# Altium project RA-Manager_Controller.PrjPcb
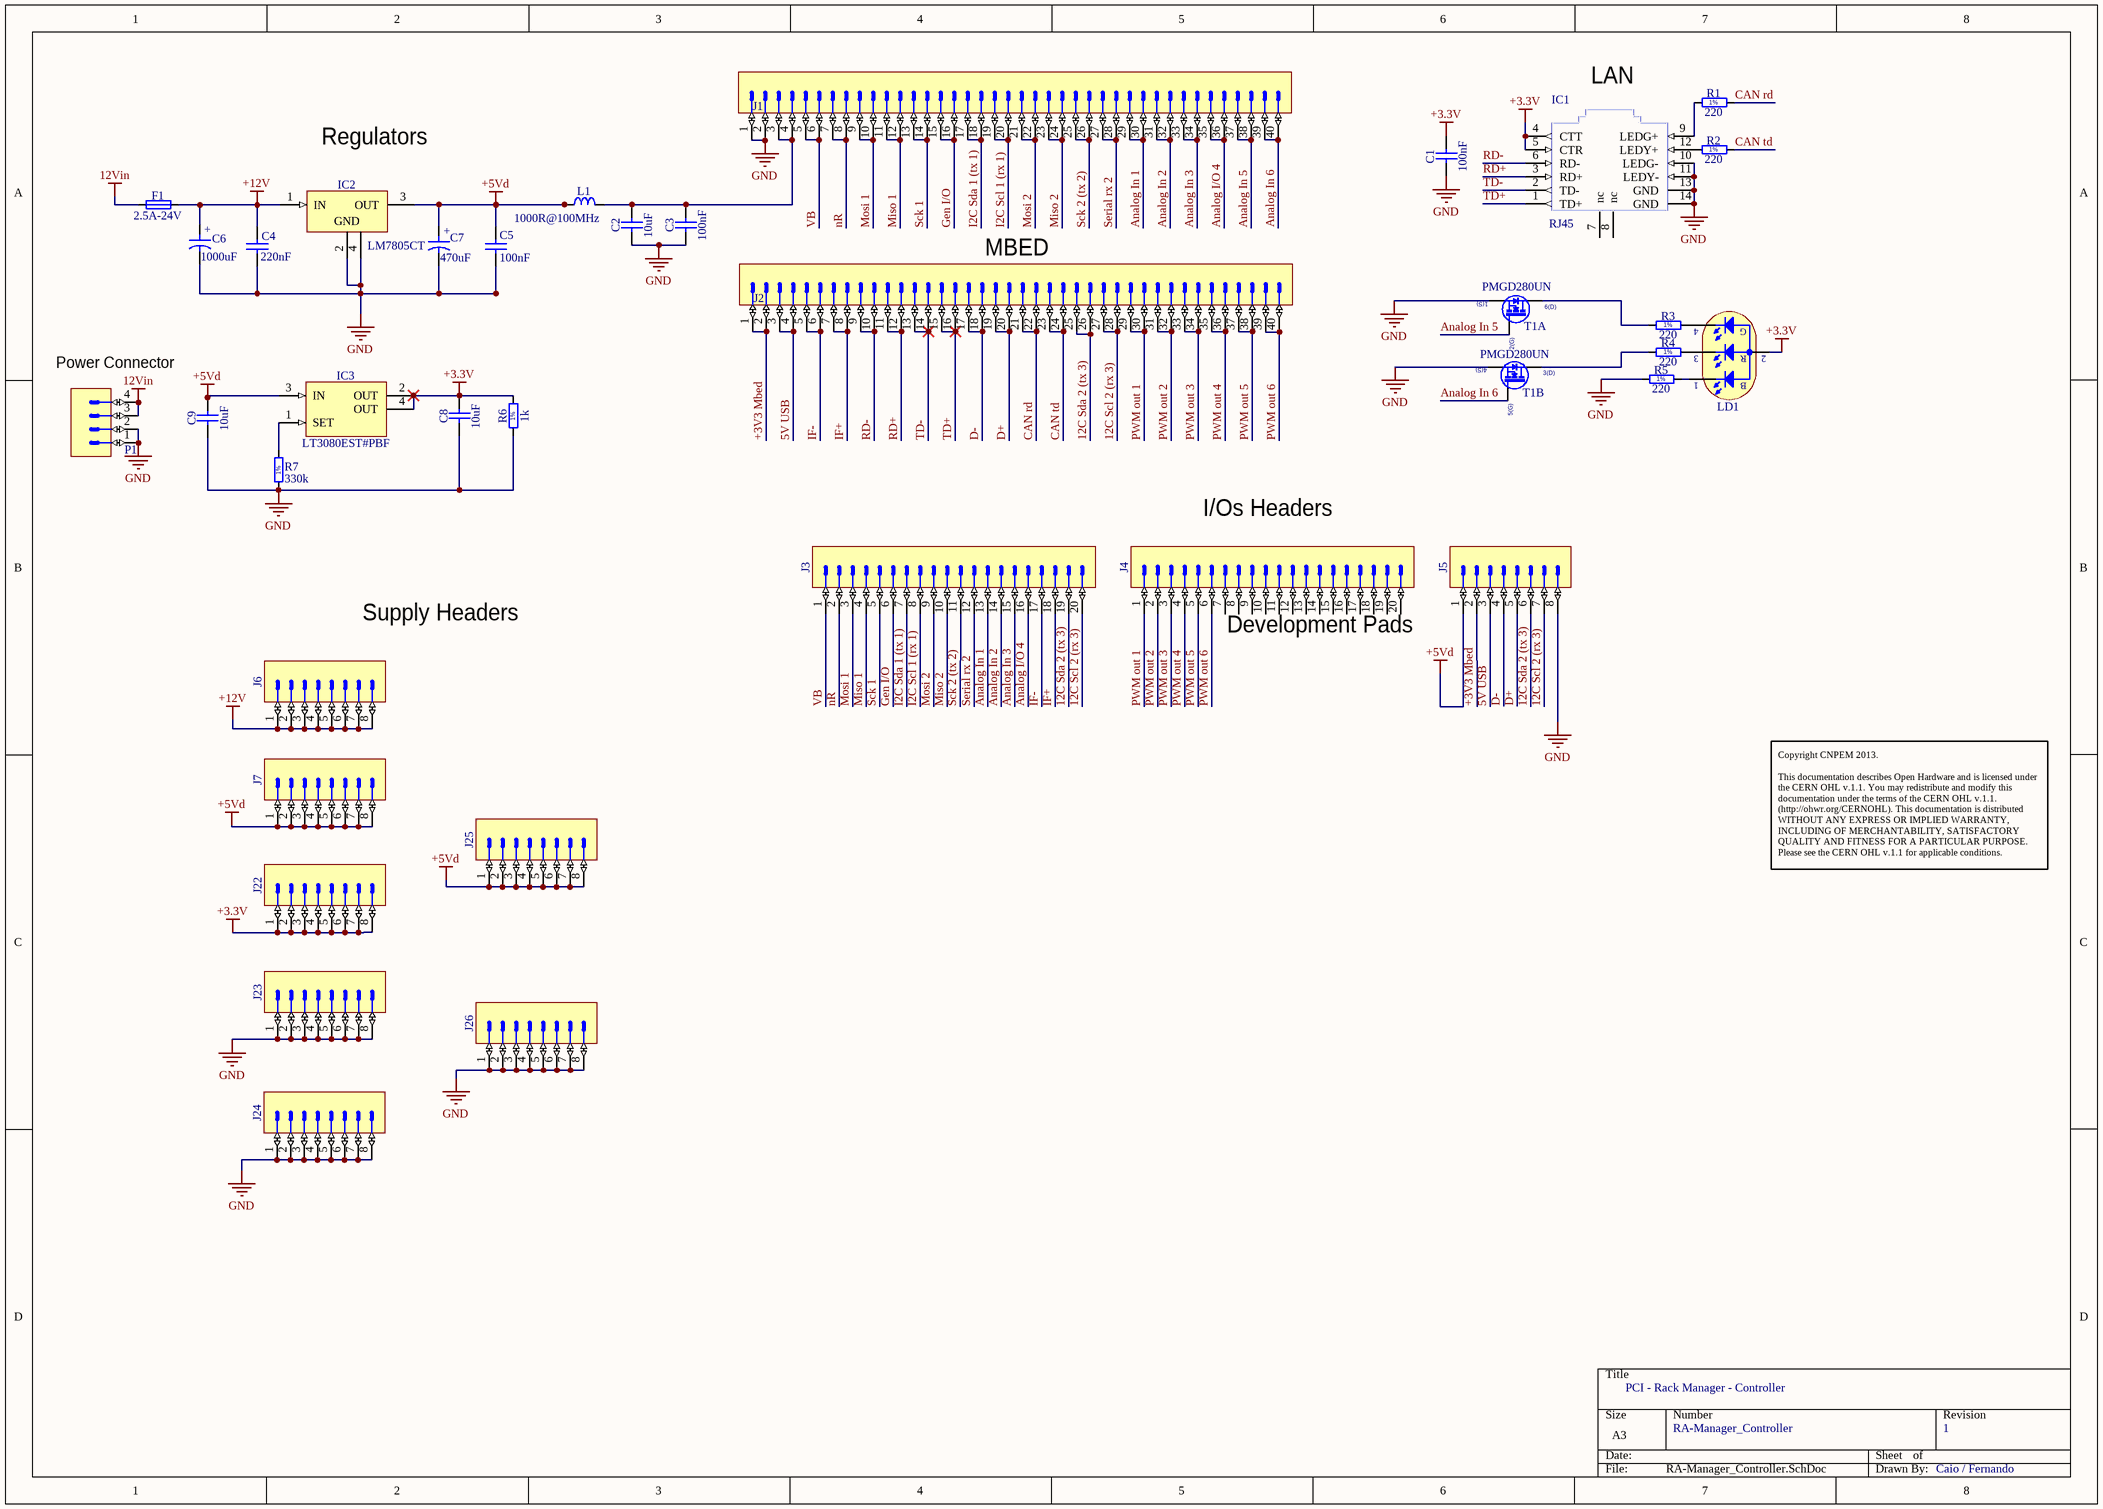
[diagram p0: RA-Manager_Controller.SchDoc]
1 sheet, 36 parts. Net scope: global (net labels, ports and power ports of the same name join across sheets).
Board file: RA-Manager_Controller.PcbDoc

## Sheet RA-Manager_Controller.SchDoc
size A3

### Parts
C1  100nF  [CAPC1608X87N]
C2  10uF  [CAPC3216X180N]
C3  100nF  [CAPC1608X87N]
C4  220nF  [CAPR500-250X720X650]
C5  100nF  [CAPR500-250X720X650]
C6  1000uF  [CAPPR500-1300X2700]
C7  470uF  [CAPPR500-1050X1150]
C8  10uF  [CAPC3216X180N]
C9  10uF  [CAPC3216X180N]
F1  2.5A-24V  [FUSC1608X55N]
IC1  RJ45  [J0006D21BNL]
IC2  LM7805CT  [TO-220-H]
IC3  LT3080EST#PBF  [SOT230P700X180-4N]
J1  (no value)  [TYCO_2-534998-0]
J2  (no value)  [TYCO_2-534998-0]
J3  (no value)  [TYCO_2-87224-0]
J4  (no value)  [TYCO_2-87224-0]
J5  (no value)  [HARWIN_D01-9922046_8OF20]
J6  (no value)  [HARWIN_D01-9922046_8OF20]
J7  (no value)  [HARWIN_D01-9922046_8OF20]
J22  (no value)  [HARWIN_D01-9922046_8OF20]
J23  (no value)  [HARWIN_D01-9922046_8OF20]
J24  (no value)  [HARWIN_D01-9922046_8OF20]
J25  (no value)  [HARWIN_D01-9922046_8OF20]
J26  (no value)  [HARWIN_D01-9922046_8OF20]
L1  1000R@100MHz  [INDC1608X95N]
LD1  Blue/Red/Green  [LED_AVAGO_HSMF-C113]  (value not drawn)
P1  Header 4  [JST_B4B-XH-A(LF)(SN)]  (value not drawn)
R1  220  [RESC2012X60N]
R2  220  [RESC2012X60N]
R3  220  [RESC2012X60N]
R4  220  [RESC2012X60N]
R5  220  [RESC2012X60N]
R6  1k  [RESC1608X55N]
R7  330k  [RESC2012X60N]
T1  PMGD280UN  [SOT65P210X110-6N]  (parts A,B of 2)

### Nets
12Vin: F1.1 P1.3 P1.4
+3.3V: C1.2 C8.2 IC1.4(CTT) IC1.5(CTR) IC3.2(OUT) IC3.4(OUT) J22.1 J22.2 J22.3 J22.4 J22.5 J22.6 J22.7 J22.8 LD1.2(AC) R6.2
+5Vd: C5.2 C7.1 C9.2 IC2.3(OUT) IC3.3(IN) J5.1 J7.1 J7.2 J7.3 J7.4 J7.5 J7.6 J7.7 J7.8 J25.1 J25.2 J25.3 J25.4 J25.5 J25.6 J25.7 J25.8 L1.1
+12V: C4.2 C6.1 F1.2 IC2.1(IN) J6.1 J6.2 J6.3 J6.4 J6.5 J6.6 J6.7 J6.8
GND: C1.1 C2.1 C3.1 C4.1 C5.1 C6.2 C7.2 C8.1 C9.1 IC1.10(LEDG-) IC1.11(LEDY-) IC1.13(GND) IC1.14(GND) IC2.2(GND) IC2.4(GND) J1.1 J1.2 J5.8 J23.1 J23.2 J23.3 J23.4 J23.5 J23.6 J23.7 J23.8 J24.1 J24.2 J24.3 J24.4 J24.5 J24.6 J24.7 J24.8 J26.1 J26.2 J26.3 J26.4 J26.5 J26.6 J26.7 J26.8 P1.1 P1.2 R5.1 R6.1 R7.1 T1.1(S) T1.4(S)
5V USB: J2.3 J2.4 J5.3
12C Scl 2 (rx 3): J2.27 J2.28 J3.20 J5.7
12C Sda 2 (tx 3): J2.25 J2.26 J3.19 J5.6
+3V3 Mbed: J2.1 J2.2 J5.2
Analog I/O 4: J1.35 J1.36 J3.16
Analog In 1: J1.29 J1.30 J3.13
Analog In 2: J1.31 J1.32 J3.14
Analog In 3: J1.33 J1.34 J3.15
Analog In 5: J1.37 J1.38 T1.2(G)
Analog In 6: J1.39 J1.40 T1.5(G)
CAN rd: J2.21 J2.22 R1.2
CAN td: J2.23 J2.24 R2.2
D+: J2.19 J2.20 J5.5
D-: J2.17 J2.18 J5.4
Gen I/O: J1.15 J1.16 J3.6
I2C Scl 1 (rx 1): J1.19 J1.20 J3.8
I2C Sda 1 (tx 1): J1.17 J1.18 J3.7
IF+: J2.7 J2.8 J3.18
IF-: J2.5 J2.6 J3.17
Miso 1: J1.11 J1.12 J3.4
Miso 2: J1.23 J1.24 J3.10
Mosi 1: J1.9 J1.10 J3.3
Mosi 2: J1.21 J1.22 J3.9
nR: J1.7 J1.8 J3.2
PWM out 1: J2.29 J2.30 J4.1
PWM out 2: J2.31 J2.32 J4.2
PWM out 3: J2.33 J2.34 J4.3
PWM out 4: J2.35 J2.36 J4.4
PWM out 5: J2.37 J2.38 J4.5
PWM out 6: J2.39 J2.40 J4.6
RD+: IC1.3(RD+) J2.11 J2.12
RD-: IC1.6(RD-) J2.9 J2.10
Sck 1: J1.13 J1.14 J3.5
Sck 2 (tx 2): J1.25 J1.26 J3.11
Serial rx 2: J1.27 J1.28 J3.12
TD+: IC1.1(TD+) J2.15 J2.16
TD-: IC1.2(TD-) J2.13 J2.14
VB: J1.5 J1.6 J3.1
NetC2_2: C2.2 C3.2 J1.3 J1.4 L1.2
NetIC1_9: IC1.9(LEDG+) R1.1
NetIC1_12: IC1.12(LEDY+) R2.1
NetIC3_1: IC3.1(SET) R7.2
NetLD1_1: LD1.1(CB) R5.2
NetLD1_3: LD1.3(CR) R4.2
NetLD1_4: LD1.4(CG) R3.2
NetR3_1: R3.1 T1.6(D)
NetR4_1: R4.1 T1.3(D)

Not connected (* = marked no-connect by the designer): IC1 7(nc) 8(nc); J4 7 8 9 10 11 12 13 14 15 16 17 18 19 20

### Notes on the sheet
- (near IC1) LAN
- (near IC2) Regulators
- (near J2) MBED
- Power Connector
- I/Os Headers
- Supply Headers
- (near J4) Development Pads
- Copyright CNPEM 2013.
  This documentation describes Open Hardware and is licensed under the CERN OHL v.1.1. You may redistribute and modify this documentation under the terms of the CERN OHL v.1.1. (http://ohwr.org/CERNOHL). This documentation is distributed WITHOUT ANY EXPRESS OR IMPLIED WARRANTY, INCLUDING OF MERCHANTABILITY, SATISFACTORY QUALITY AND FITNESS FOR A PARTICULAR PURPOSE. Please see the CERN OHL v.1.1 for applicable conditions.
- PCI - Rack Manager - Controller
- RA-Manager_Controller
- 1
- Caio / Fernando
- (in symbol CAER_470UF_10V_20%_500-1050X1150_LESR0R015) +
- (in symbol CAER_1000UF_25V_20%_500-1300X2700_LESR0R034) +
- (in symbol LED_AVAGO_HSMF-C113) G; R; B
- (in symbol PMGD280UN, part A) 6(D); 1(S); 2(G)
- (in symbol PMGD280UN, part B) 3(D); 4(S); 5(G)
- (in symbol R0603_1K_1%_0.1W_100PPM) 1%
- (in symbol R0805_220R_1%_0.125W_100PPM) 1%
- (in symbol R0805_330K_1%_0.125W_100PPM) 1%

### Library data of the parts
C1 C3 = CC0603_100NF_50V_10%_X7R: Non-polarised capacitor; Manufacturer: GENERIC; Part Description: SMD Multilayer Chip Ceramic Capacitor; Manufacturer1 Part Number: 223858615649; Tolerance: ±10%; Voltage: 50V; TC: X7R; Manufacturer Part Number: CC0603_100NF_50V_10%_X7R; Part Number: CC0603_100NF_50V_10%_X7R; Component Kind: Standard; Component Type: Standard; Pin Count: 2; Value: 100nF; Status: Preferred; Case: 0603; Mounted: Yes; Socket: No; SMD: Yes; Sense: No; Manufacturer1 Example: PHYCOMP; Manufacturer1 ComponentHeight: 0.87mm; HelpURL: \\cern.ch\dfs\Applications\Altium\Datasheets\CC0603_X7R_PHYCOMP.pdf; Author: CERN DEM JLC; CreateDate: 03/12/2007; LatestRevisionDate: 03/12/2007
C2 C8 C9 = CC1206_10UF_25V_10%_X7R: Non-polarised capacitor; Manufacturer: GENERIC; Part Description: SMD Multilayer Chip Ceramic Capacitor; Manufacturer1 Part Number: C1206C106K4RACTU; Tolerance: ±10%; Voltage: 25V; TC: X7R; Manufacturer Part Number: CC1206_10uF_25V_10%_X7R; Part Number: CC1206_10UF_25V_10%_X7R; Component Kind: Standard; Component Type: Standard; Pin Count: 2; Value: 10uF; Status: Preferred; Case: 1206; Mounted: Yes; Socket: No; SMD: Yes; Sense: No; Manufacturer1 Example: KEMET; Manufacturer1 ComponentHeight: 1.8mm; HelpURL: \\cern.ch\dfs\Applications\Altium\Datasheets\CC1206_X7R_KEMET.pdf; Author: CERN DEM JLC; CreateDate: 12/09/2012; LatestRevisionDate: 12/09/2012
C4 = CPER_220NF_63V_10%_500-250X720X650: Non-polarised capacitor; Part Description: Metallized Polyester Film Capacitor (MKT); Manufacturer: TDK; Manufacturer Part Number: B32529C0224K000; Voltage: 63VDC/40VAC; Tolerance: ±10%; Part Number: CPER_220NF_63V_10%_500-250X720X650; Component Kind: Standard; Component Type: Standard; Pin Count: 2; Value: 220nF; Status: None; Case: LS5 W2.5 x L7.2 x H6.5; Mounted: Yes; Socket: No; SMD: No; Sense: No; ComponentHeight: 6.5mm; HelpURL: \\cern.ch\dfs\Applications\Altium\Datasheets\CPER_TDK_B32529.pdf; Author: CERN DEM JLC; CreateDate: 19/12/2007; LatestRevisionDate: 22/04/2015
C5 = CPER_100NF_63V_10%_500-250X720X650: Non-polarised capacitor; Part Description: Metallized Polyester Film Capacitor (MKT); Manufacturer: TDK; Manufacturer Part Number: B32529C0104K000; Voltage: 63VDC/40VAC; Tolerance: ±10%; Part Number: CPER_100NF_63V_10%_500-250X720X650; Component Kind: Standard; Component Type: Standard; Pin Count: 2; Value: 100nF; Status: None; Case: LS5 W2.5 x L7.2 x H6.5; Mounted: Yes; Socket: No; SMD: No; Sense: No; ComponentHeight: 6.5mm; HelpURL: \\cern.ch\dfs\Applications\Altium\Datasheets\CPER_TDK_B32529.pdf; Author: CERN DEM JLC; CreateDate: 19/12/2007; LatestRevisionDate: 19/12/2007
C6 = CAER_1000UF_25V_20%_500-1300X2700_LESR0R034: Polarised capacitor; Part Description: Low ESR 0R034 Aluminum Electrolytic Capacitor (136RVI Series); Manufacturer: VISHAY BCCOMPONENTS; Manufacturer Part Number: MAL213666102E3; Voltage: 25V; Tolerance: ±20%; Part Number: CAER_1000UF_25V_20%_500-1300X2700_LESR0R034; Component Kind: Standard; Component Type: Standard; Pin Count: 2; Value: 1000uF; Status: Preferred; Case: LS5 D13 x H27; Mounted: Yes; Socket: No; SMD: No; Sense: No; ComponentHeight: 27mm; HelpURL: \\cern.ch\dfs\Applications\Altium\Datasheets\CAER-LESR_VISHAY_136RVI.pdf; Author: CERN DEM JLC; CreateDate: 03/07/2008; LatestRevisionDate: 16/03/2009
C7 = CAER_470UF_10V_20%_500-1050X1150_LESR0R015: Polarised capacitor; Part Description: Low ESR 0R015 Aluminum Solid Capacitor With Organic Semiconductive Electrolyte; Manufacturer: SANYO OS-CON; Manufacturer Part Number: 10SP470M; Voltage: 10V; Tolerance: ±20%; Part Number: CAER_470UF_10V_20%_500-1050X1150_LESR0R015; Component Kind: Standard; Component Type: Standard; Pin Count: 2; Value: 470uF; Status: Obsolete; Case: LS5 D10.5 x H11.5; Mounted: Yes; Socket: No; SMD: No; Sense: No; ComponentHeight: 11.5mm; HelpURL: \\cern.ch\dfs\Applications\Altium\Datasheets\CAER-LESR_SANYO_SP.pdf; Author: CERN DEM JLC; CreateDate: 29/01/2008; LatestRevisionDate: 16/03/2009
F1 = FUS0603_BOURNS-SF-0603F250-2: Fuse; Part Description: Thin Film Chip Fuse; Manufacturer: BOURNS; PressFit: No; Part Number: FUS0603_BOURNS-SF-0603F250-2; Component Kind: Standard; Component Type: Standard; Pin Count: 2; PackageDescription: Chip Fuse, 2-Leads, Body 1.6mm x 0.8mm, IPC Medium Density; Family: Fuse; Mounted: Yes; Socket: No; SMD: Yes; Sense: No; Value: 2.5A-24V; Manufacturer Part Number: SF-0603F250-2; ComponentHeight: 0.55mm; HelpURL: \\cern.ch\dfs\Applications\Altium\Datasheets\FUSE_BOURNS_SF-0603F.pdf; Author: CERN DEM JLC; CreateDate: 31/03/2010; LatestRevisionDate: 31/03/2010
IC1 = J0006D21BNL: CONN MAGJACK 1PORT 100 BASE-TX; Manufacturer: Pulse Electronics Corporation; Part Description: 1 Port, 1x1 Tab-Down 10/100BASE-TX RJ45 FastJack Connector Module With LEDs Y/G; Number of Ports: 1; LED Color: Green - Yellow; Number of Cores per Jack: 4; Shielding: Shielded; Tab Direction: Down; Shield Material: Brass; PressFit: No; Supplier 1: Digi-Key; Manufacturer Part Number: J0006D21BNL; RoHS: RoHS Compliant; Category: Connectors, Interconnects; Stock 1: 1565; Pricing 1: 1=6.38, 25=5.586, 50=5.32, 100=5.054, 250=4.522, 500=4.256, 1000=3.724, 2500=3.5378, 5000=3.458 (USD); Packaging: Bulk; Connector Type: RJ45; Number of Rows: 1; Applications: 10/100 Base-TX, AutoMDIX; Mounting Type: Through Hole; Orientation: 90° Angle (Right); Termination: Solder; Height Above Board: 0.545" (13.84mm); Features: Board Guide; Contact Material: Phosphor Bronze; Contact Finish: Gold; Contact Finish Thickness: 15µin (0.38µm); Housing Material: Thermoplastic; Operating Temperature: 0°C ~ 70°C; ComponentLink1URL: http://productfinder.pulseeng.com/products/datasheets/J403.pdf; ComponentLink1Description: http://productfinder.pulseeng.com/products/datasheets/J403.pdf; Supplier Part Number 1: J0006D21BNL; Part Number: J0006D21BNL; Component Kind: Standard; Component Type: Standard; Pin Count: 16; Family: RJ45; Mounted: Yes; Socket: No; SMD: No; Sense: No; Status: None; ComponentHeight: 13.84mm; HelpURL: http://productfinder.pulseeng.com/products/datasheets/J403.pdf; Author: LNLS DIG FCS; CreateDate: 28/06/2016; LatestRevisionDate: 28/06/2016
IC2 = LM7805CT_h: 3-Terminal Regulator 1=IN 2=GND 3=OUT 4=GND; Part Description: 3-Terminal 5V 1A Positive Voltage Regulator; Manufacturer: FAIRCHILD SEMICONDUCTOR; PressFit: No; Bonding: No; Part Number: LM7805CT_h; Component Kind: Standard; Component Type: Standard; Device: LM7805CT; PackageDescription: TO-220 3-Terminal + Tab - Horizontal Mount; Manufacturer Part Number: LM7805CT; Pin Count: 4; Case: TO-220; Mounted: Yes; Socket: No; SMD: No; Sense: No; ComponentHeight: 4.7mm; HelpURL: \\cern.ch\dfs\Applications\Altium\Datasheets\LM7805CT.pdf; Author: CERN DEM JLC; CreateDate: 18/03/2008; LatestRevisionDate: 18/03/2008
IC3 = LT3080EST#PBF: 200mA, Programmable Current Source; Part Description: 0 To 36V Adjustable 1.1A Single Resistor Low Dropout Regulator; Manufacturer: LINEAR TECHNOLOGY; PressFit: No; Bonding: No; Part Number: LT3080EST#PBF; Component Kind: Standard; Component Type: Standard; Device: LT3080EST#PBF; PackageDescription: SOT223, 2.30mm pitch; 3 pin, 3.70mm W X 6.70mm L, IPC Medium Density; Manufacturer Part Number: LT3080EST#PBF; Pin Count: 4; Case: SOT223; Mounted: Yes; Socket: No; SMD: Yes; Sense: No; ComponentHeight: 1.8mm; HelpURL: http://cds.linear.com/docs/en/datasheet/3080fc.pdf; Author: LNLS DIG FCS; CreateDate: 04/07/2016; LatestRevisionDate: 04/07/2016
J1 J2 = TYCO_2-534998-0: Connector 40 Male; Part Description: 40 Contacts, Vertical Low Profile IDC Shrouded Header with Ejection Latches; Manufacturer: TYCO ELECTRONICS; PressFit: No; Part Number: TYCO_2-534998-0; Component Kind: Standard; Component Type: Standard; Pin Count: 40; Family: AMP-LATCH; Mounted: Yes; Socket: No; SMD: No; Sense: No; Status: None; Manufacturer Part Number: 2-534998-0; ComponentHeight: 6.22mm; HelpURL: http://www.te.com/commerce/DocumentDelivery/DDEController?Action=srchrtrv&DocNm=534998&DocType=Customer+Drawing&DocLang=English; Author: LNLS DIG FCS; CreateDate: 28/06/2016; LatestRevisionDate: 28/06/2016
J3 J4 = TYCO_2-87224-0: Connector 20 Male; Part Description: 20 Contacts, Connector header vertical; Manufacturer: TYCO ELECTRONICS; PressFit: No; Part Number: TYCO_2-87224-0; Component Kind: Standard; Component Type: Standard; Pin Count: 20; Mounted: Yes; Socket: No; SMD: No; Sense: No; Status: None; Manufacturer Part Number: 2-87224-0; ComponentHeight: 13.5mm; Author: LNLS DIG LOS; CreateDate: 16/11/2017; LatestRevisionDate: 16/11/2017
J5-J7 J22-J26 = HARWIN_D01-9922046_8OF20: Connector 8 Male; Part Description: 8 of 20 Contact 2.54mm Pitch Single-In-Line Header Strip -  Top Pin Ø0.46mm - Bottom Pin Ø0.69mm; Manufacturer: HARWIN; PressFit: No; Part Number: HARWIN_D01-9922046_8OF20; Component Kind: Standard; Component Type: Standard; Pin Count: 8; Mounted: Yes; Socket: No; SMD: No; Sense: No; Status: None; Manufacturer Part Number: D01-9922046; ComponentHeight: 7.43mm; HelpURL: \\cern.ch\dfs\Applications\Altium\Datasheets\HARWIN_D01-9922046.pdf; Author: CERN DEM JLC; CreateDate: 08/12/2008; LatestRevisionDate: 08/12/2008
L1 = IND0603_MURATA_BLM18HE102SN1: Inductor; Part Description: SMD EMIFIL Suppression Chip Ferrite Bead; Manufacturer: MURATA; Power: 600mA; Resistance: 0.35R; Tolerance: ±25%; Part Number: IND0603_MURATA_BLM18HE102SN1; Component Kind: Standard; Component Type: Standard; Pin Count: 2; Value: 1000R@100MHz; Status: None; Manufacturer Part Number: BLM18HE102SN1; Case: 0603; Mounted: Yes; Socket: No; SMD: Yes; Sense: No; ComponentHeight: 0.95mm; HelpURL: \\cern.ch\dfs\Applications\Altium\Datasheets\IND0603_MURATA_BLM18H.pdf; Author: CERN DEM JLC; CreateDate: 09/12/2013; LatestRevisionDate: 09/12/2013
LD1 = LED_AVAGO_HSMF-C113: Tricolor LEDs 1 Cathode Blue, 2 Common Anode, 3 Cathode Red, 4 Cathode Green; Part Description: Right Angle Tricolor (Blue, Red, Green) Surface Mount ChipLED; Manufacturer: AVAGO TECHNOLOGIES; PressFit: No; Bonding: No; Part Number: LED_AVAGO_HSMF-C113; Component Kind: Standard; Component Type: Standard; Color: Blue/Red/Green; PackageDescription: Right Angle Tricolor Surface Mount ChipLED, Body 2.5x1mm; Manufacturer Part Number: HSMF-C113; Pin Count: 4; Mounted: Yes; Socket: No; SMD: Yes; Sense: No; ComponentHeight: 1mm; HelpURL: \\cern.ch\dfs\Applications\Altium\Datasheets\LED_AVAGO_HSMF-C113.pdf; Author: CERN DEM JLC; CreateDate: 29/09/2010; LatestRevisionDate: 29/09/2010
P1 = JST_B4B-XH-A(LF)(SN): Connector 4 Male; Part Description: 4 Contacts, 2.5mm Pitch, Top Entry Type Shrouded Header; Manufacturer: JST (JAPAN SOLDERLESS TERMINALS); PressFit: No; LatestRevisionDate: 14/08/2014; Part Number: JST_B4B-XH-A(LF)(SN); Component Kind: Standard; Component Type: Standard; Pin Count: 4; Family: Header 4; Mounted: Yes; Socket: No; SMD: No; Sense: No; Status: None; Manufacturer Part Number: B4B-XH-A(LF)(SN); ComponentHeight: 7mm; HelpURL: \\cern.ch\dfs\Applications\Altium\Datasheets\JST_B4B-XH-A(LF)(SN).pdf; Author: CERN DEM JLC; CreateDate: 14/08/2014
R1-R5 = R0805_220R_1%_0.125W_100PPM: Resistor - 1%; Manufacturer: GENERIC; Part Description: General Purpose Thick Film Chip Resistor; Manufacturer1 Part Number: NRC10F2200TRF; Power: 0.125W; TC: ±100ppm/°C; Manufacturer Part Number: R0805_220R_1%_0.125W_100PPM; Tolerance: ±1%; Part Number: R0805_220R_1%_0.125W_100PPM; Component Kind: Standard; Component Type: Standard; Pin Count: 2; Value: 220; Status: Preferred; Case: 0805; Mounted: Yes; Sense: No; Socket: No; SMD: Yes; Manufacturer1 Example: NIC COMPONENT; Manufacturer1 ComponentHeight: 0.6mm; HelpURL: \\cern.ch\dfs\Applications\Altium\Datasheets\R0805_NIC_NRC.pdf; Author: CERN DEM JLC; CreateDate: 03/12/2007; LatestRevisionDate: 13/03/2008
R6 = R0603_1K_1%_0.1W_100PPM: Resistor - 1%; Manufacturer: GENERIC; Part Description: General Purpose Thick Film Chip Resistor; Manufacturer1 Part Number: NRC06F1001TRF; Power: 0.1W; TC: ±100ppm/°C; Manufacturer Part Number: R0603_1K_1%_0.1W_100PPM; Tolerance: ±1%; Part Number: R0603_1K_1%_0.1W_100PPM; Component Kind: Standard; Component Type: Standard; Pin Count: 2; Value: 1k; Status: Preferred; Case: 0603; Mounted: Yes; Sense: No; Socket: No; SMD: Yes; Manufacturer1 Example: NIC COMPONENT; Manufacturer1 ComponentHeight: 0.55mm; HelpURL: \\cern.ch\dfs\Applications\Altium\Datasheets\R0603_NIC_NRC.pdf; Author: CERN DEM JLC; CreateDate: 03/12/2007; LatestRevisionDate: 13/03/2008
R7 = R0805_330K_1%_0.125W_100PPM: Resistor - 1%; Manufacturer: GENERIC; Part Description: General Purpose Thick Film Chip Resistor; Manufacturer1 Part Number: NRC10F3303TRF; Power: 0.125W; TC: ±100ppm/°C; Manufacturer Part Number: R0805_330K_1%_0.125W_100PPM; Tolerance: ±1%; Part Number: R0805_330K_1%_0.125W_100PPM; Component Kind: Standard; Component Type: Standard; Pin Count: 2; Value: 330k; Status: Preferred; Case: 0805; Mounted: Yes; Sense: No; Socket: No; SMD: Yes; Manufacturer1 Example: NIC COMPONENT; Manufacturer1 ComponentHeight: 0.6mm; HelpURL: \\cern.ch\dfs\Applications\Altium\Datasheets\R0805_NIC_NRC.pdf; Author: CERN DEM JLC; CreateDate: 03/12/2007; LatestRevisionDate: 13/03/2008
T1 = PMGD280UN: Dual N-Channel micro TrenchMOS™ Ultra Low Level FET; Part Description: 20V 870mA Dual N-Channel micro TrenchMOS™ Ultra Low Level FET; Manufacturer: NXP SEMICONDUCTORS; PressFit: No; Bonding: No; Part Number: PMGD280UN; Component Kind: Standard; Component Type: Standard; Device: PMGD280UN; PackageDescription: SOT363, SC70-6, SOT, 0.65mm Pitch, 6 pin, 1.25mm W X 2.00mm L X 1.10mm H, IPC Medium Density; Manufacturer Part Number: PMGD280UN; Pin Count: 6; Case: SOT363; Mounted: Yes; Socket: No; SMD: Yes; Sense: No; ComponentHeight: 1.1mm; HelpURL: \\cern.ch\dfs\Applications\Altium\Datasheets\PMGD280UN.pdf; Author: CERN DEM JLC; CreateDate: 19/11/2014; LatestRevisionDate: 19/11/2014